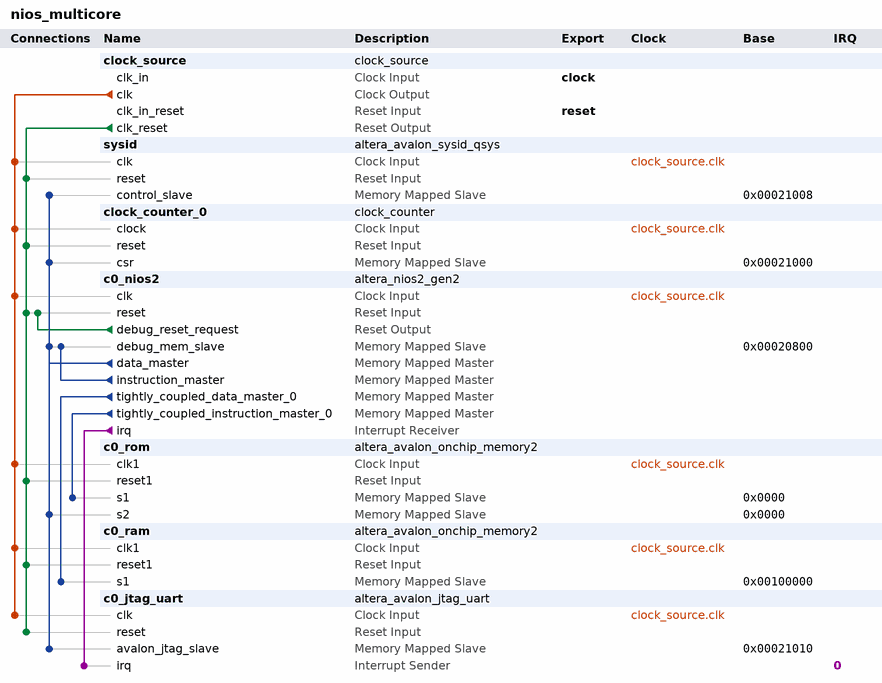
[diagram p0: system contents]
# Platform Designer (Qsys) system nios_multicore, Cyclone IV GX EP4CGX150DF31C7
# Parameters at their usual value, and those the tool derives, are not listed.
package require -exact qsys 23.1
create_system nios_multicore
set_project_property DEVICE_FAMILY {Cyclone IV GX}
set_project_property DEVICE EP4CGX150DF31C7

add_instance clock_source clock_source 23.1
set_instance_parameter_value clock_source clockFrequency 50000000

add_instance sysid altera_avalon_sysid_qsys 23.1
set_instance_parameter_value sysid id -559038737

add_instance clock_counter_0 clock_counter 1.0

add_instance c0_nios2 altera_nios2_gen2 23.1
set_instance_parameter_value c0_nios2 dcache_numTCDM 1
set_instance_parameter_value c0_nios2 dcache_size 0
set_instance_parameter_value c0_nios2 exceptionSlave c0_rom.s1
set_instance_parameter_value c0_nios2 icache_numTCIM 1
set_instance_parameter_value c0_nios2 icache_size 0
set_instance_parameter_value c0_nios2 impl Fast
set_instance_parameter_value c0_nios2 resetSlave c0_rom.s1

add_instance c0_rom altera_avalon_onchip_memory2 23.1
set_instance_parameter_value c0_rom dataWidth 32
set_instance_parameter_value c0_rom dualPort true
set_instance_parameter_value c0_rom initMemContent false
set_instance_parameter_value c0_rom initializationFileName onchip_mem.hex
set_instance_parameter_value c0_rom memorySize 90000
set_instance_parameter_value c0_rom singleClockOperation true

add_instance c0_ram altera_avalon_onchip_memory2 23.1
set_instance_parameter_value c0_ram dataWidth 32
set_instance_parameter_value c0_ram dualPort false
set_instance_parameter_value c0_ram initMemContent false
set_instance_parameter_value c0_ram initializationFileName onchip_mem.hex
set_instance_parameter_value c0_ram memorySize 560000
set_instance_parameter_value c0_ram singleClockOperation true

add_instance c0_jtag_uart altera_avalon_jtag_uart 23.1
set_instance_parameter_value c0_jtag_uart simInteractiveOptions NO_INTERACTIVE_WINDOWS

# connections
add_connection clock_source.clk c0_jtag_uart.clk clock
add_connection clock_source.clk c0_nios2.clk clock
add_connection clock_source.clk c0_ram.clk1 clock
add_connection clock_source.clk c0_rom.clk1 clock
add_connection clock_source.clk clock_counter_0.clock clock
add_connection clock_source.clk sysid.clk clock
add_connection c0_nios2.debug_reset_request c0_nios2.reset reset
add_connection clock_source.clk_reset c0_jtag_uart.reset reset
add_connection clock_source.clk_reset c0_nios2.reset reset
add_connection clock_source.clk_reset c0_ram.reset1 reset
add_connection clock_source.clk_reset c0_rom.reset1 reset
add_connection clock_source.clk_reset clock_counter_0.reset reset
add_connection clock_source.clk_reset sysid.reset reset
add_connection c0_nios2.data_master c0_jtag_uart.avalon_jtag_slave avalon
set_connection_parameter_value c0_nios2.data_master/c0_jtag_uart.avalon_jtag_slave baseAddress 0x00021010
add_connection c0_nios2.data_master c0_nios2.debug_mem_slave avalon
set_connection_parameter_value c0_nios2.data_master/c0_nios2.debug_mem_slave baseAddress 0x00020800
add_connection c0_nios2.data_master c0_rom.s2 avalon
set_connection_parameter_value c0_nios2.data_master/c0_rom.s2 baseAddress 0x0000
add_connection c0_nios2.data_master clock_counter_0.csr avalon
set_connection_parameter_value c0_nios2.data_master/clock_counter_0.csr baseAddress 0x00021000
add_connection c0_nios2.data_master sysid.control_slave avalon
set_connection_parameter_value c0_nios2.data_master/sysid.control_slave baseAddress 0x00021008
add_connection c0_nios2.instruction_master c0_nios2.debug_mem_slave avalon
set_connection_parameter_value c0_nios2.instruction_master/c0_nios2.debug_mem_slave baseAddress 0x00020800
add_connection c0_nios2.tightly_coupled_data_master_0 c0_ram.s1 avalon
set_connection_parameter_value c0_nios2.tightly_coupled_data_master_0/c0_ram.s1 baseAddress 0x00100000
add_connection c0_nios2.tightly_coupled_instruction_master_0 c0_rom.s1 avalon
set_connection_parameter_value c0_nios2.tightly_coupled_instruction_master_0/c0_rom.s1 baseAddress 0x0000
add_connection c0_nios2.irq c0_jtag_uart.irq interrupt
set_connection_parameter_value c0_nios2.irq/c0_jtag_uart.irq irqNumber 0

# exported interfaces
add_interface clock clock sink
set_interface_property clock EXPORT_OF clock_source.clk_in
add_interface reset reset sink
set_interface_property reset EXPORT_OF clock_source.clk_in_reset

set_interconnect_requirement {$system} qsys_mm.clockCrossingAdapter HANDSHAKE
set_interconnect_requirement {$system} qsys_mm.enableEccProtection FALSE
set_interconnect_requirement {$system} qsys_mm.insertDefaultSlave FALSE
set_interconnect_requirement {$system} qsys_mm.maxAdditionalLatency 1

save_system nios_multicore.qsys
